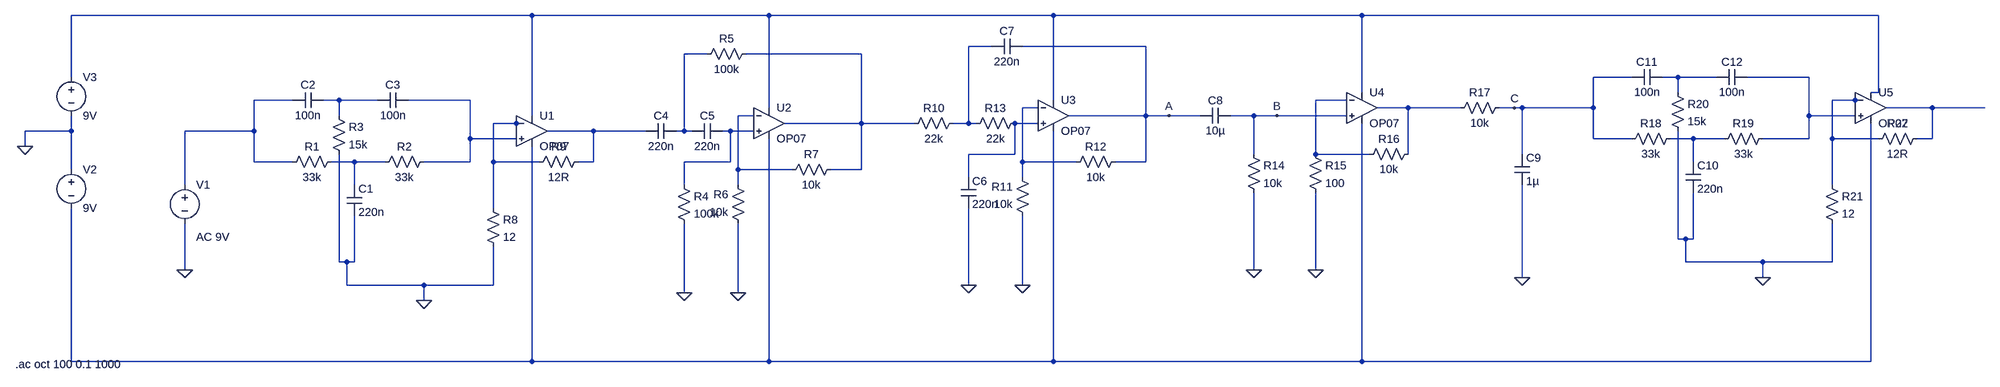
[diagram p0: schematic lab2.asc]
lab2.asc, the LTspice schematic file:
Version 4
SHEET 1 3988 680
WIRE 688 -224 -304 -224
WIRE 1200 -224 688 -224
WIRE 1840 -224 1200 -224
WIRE 2480 -224 1840 -224
WIRE 3600 -224 2480 -224
WIRE 1712 -160 1664 -160
WIRE 2032 -160 1776 -160
WIRE 1072 -144 1024 -144
WIRE 1392 -144 1152 -144
WIRE -304 -96 -304 -224
WIRE 3088 -96 3008 -96
WIRE 3184 -96 3152 -96
WIRE 3264 -96 3184 -96
WIRE 3456 -96 3328 -96
WIRE 2480 -64 2480 -224
WIRE 3184 -64 3184 -96
WIRE 3600 -64 3600 -224
WIRE 3600 -64 3584 -64
WIRE 192 -48 112 -48
WIRE 288 -48 256 -48
WIRE 368 -48 288 -48
WIRE 560 -48 432 -48
WIRE 1840 -48 1840 -224
WIRE 2448 -48 2384 -48
WIRE 3552 -48 3504 -48
WIRE 3568 -48 3552 -48
WIRE 1200 -32 1200 -224
WIRE 1808 -32 1776 -32
WIRE 2576 -32 2512 -32
WIRE 2688 -32 2576 -32
WIRE 2800 -32 2768 -32
WIRE 2816 -32 2800 -32
WIRE 3008 -32 3008 -96
WIRE 3008 -32 2816 -32
WIRE 3712 -32 3616 -32
WIRE 3984 -32 3712 -32
WIRE 288 -16 288 -48
WIRE 688 -16 688 -224
WIRE 1168 -16 1136 -16
WIRE 2032 -16 2032 -160
WIRE 2032 -16 1872 -16
WIRE 2080 -16 2032 -16
WIRE 2144 -16 2080 -16
WIRE 2256 -16 2208 -16
WIRE 2304 -16 2256 -16
WIRE 2448 -16 2304 -16
WIRE 3456 -16 3456 -96
WIRE 3552 -16 3456 -16
WIRE 656 0 608 0
WIRE 672 0 656 0
WIRE 1392 0 1392 -144
WIRE 1392 0 1232 0
WIRE 1552 0 1392 0
WIRE 1664 0 1664 -160
WIRE 1664 0 1632 0
WIRE 1680 0 1664 0
WIRE 1808 0 1760 0
WIRE -304 16 -304 -16
WIRE -304 16 -400 16
WIRE 112 16 112 -48
WIRE 112 16 -32 16
WIRE 816 16 720 16
WIRE 944 16 816 16
WIRE 1024 16 1024 -144
WIRE 1024 16 1008 16
WIRE 1040 16 1024 16
WIRE 1120 16 1104 16
WIRE 1168 16 1120 16
WIRE 560 32 560 -48
WIRE 656 32 560 32
WIRE 3008 32 3008 -32
WIRE 3088 32 3008 32
WIRE 3216 32 3168 32
WIRE 3280 32 3216 32
WIRE 3456 32 3456 -16
WIRE 3456 32 3360 32
WIRE 3504 32 3504 -48
WIRE 3600 32 3504 32
WIRE 3712 32 3712 -32
WIRE 3712 32 3680 32
WIRE -400 48 -400 16
WIRE 1760 64 1760 0
WIRE 1760 64 1664 64
WIRE 2256 64 2256 -16
WIRE 2384 64 2384 -48
WIRE 2496 64 2384 64
WIRE 2576 64 2576 -32
WIRE 2816 64 2816 -32
WIRE 112 80 112 16
WIRE 192 80 112 80
WIRE 320 80 272 80
WIRE 384 80 320 80
WIRE 560 80 560 32
WIRE 560 80 464 80
WIRE 608 80 608 0
WIRE 704 80 608 80
WIRE 816 80 816 16
WIRE 816 80 784 80
WIRE 1120 80 1120 16
WIRE 1120 80 1024 80
WIRE 1776 80 1776 -32
WIRE 1888 80 1776 80
WIRE 2032 80 2032 -16
WIRE 2032 80 1968 80
WIRE 3216 80 3216 32
WIRE -304 96 -304 16
WIRE 1136 96 1136 -16
WIRE 1248 96 1136 96
WIRE 1392 96 1392 0
WIRE 1392 96 1328 96
WIRE 1664 112 1664 64
WIRE 1776 112 1776 80
WIRE -32 128 -32 16
WIRE 320 128 320 80
WIRE 1024 128 1024 80
WIRE 1136 128 1136 96
WIRE 3504 128 3504 32
WIRE 608 176 608 80
WIRE 3184 240 3184 16
WIRE 3200 240 3184 240
WIRE 3216 240 3216 144
WIRE 3216 240 3200 240
WIRE 288 288 288 64
WIRE 304 288 288 288
WIRE 320 288 320 192
WIRE 320 288 304 288
WIRE 3200 288 3200 240
WIRE 3360 288 3200 288
WIRE 3504 288 3504 208
WIRE 3504 288 3360 288
WIRE -32 304 -32 208
WIRE 2256 304 2256 144
WIRE 2384 304 2384 144
WIRE 2816 320 2816 128
WIRE 3360 320 3360 288
WIRE 304 336 304 288
WIRE 464 336 304 336
WIRE 608 336 608 256
WIRE 608 336 464 336
WIRE 1664 336 1664 176
WIRE 1776 336 1776 192
WIRE 1024 352 1024 208
WIRE 1136 352 1136 208
WIRE 464 368 464 336
WIRE -304 496 -304 176
WIRE 688 496 688 48
WIRE 688 496 -304 496
WIRE 1200 496 1200 32
WIRE 1200 496 688 496
WIRE 1840 496 1840 16
WIRE 1840 496 1200 496
WIRE 2480 496 2480 0
WIRE 2480 496 1840 496
WIRE 3584 496 3584 0
WIRE 3584 496 2480 496
FLAG -32 304 0
FLAG -400 48 0
FLAG 1136 352 0
FLAG 1024 352 0
FLAG 1776 336 0
FLAG 1664 336 0
FLAG 2256 304 0
FLAG 2384 304 0
FLAG 2816 320 0
FLAG 2080 -16 A
FLAG 2304 -16 B
FLAG 2800 -32 C
FLAG 464 368 0
FLAG 3360 320 0
SYMBOL voltage -32 112 R0
WINDOW 123 24 124 Left 2
WINDOW 39 0 0 Left 2
SYMATTR InstName V1
SYMATTR Value ""
SYMATTR Value2 AC 9V
SYMBOL res 288 64 R90
WINDOW 0 0 56 VBottom 2
WINDOW 3 32 56 VTop 2
SYMATTR InstName R1
SYMATTR Value 33k
SYMBOL res 480 64 R90
WINDOW 0 0 56 VBottom 2
WINDOW 3 32 56 VTop 2
SYMATTR InstName R2
SYMATTR Value 33k
SYMBOL cap 304 128 R0
SYMATTR InstName C1
SYMATTR Value 220n
SYMBOL cap 256 -64 R90
WINDOW 0 0 32 VBottom 2
WINDOW 3 32 32 VTop 2
SYMATTR InstName C2
SYMATTR Value 100n
SYMBOL cap 432 -64 R90
WINDOW 0 0 32 VBottom 2
WINDOW 3 32 32 VTop 2
SYMATTR InstName C3
SYMATTR Value 100n
SYMBOL res 272 -32 R0
SYMATTR InstName R3
SYMATTR Value 15k
SYMBOL Opamps\\OP07 688 -48 R0
SYMATTR InstName U1
SYMBOL voltage -304 80 R0
WINDOW 123 0 0 Left 2
WINDOW 39 0 0 Left 2
SYMATTR InstName V2
SYMATTR Value 9V
SYMBOL voltage -304 -112 R0
WINDOW 123 0 0 Left 2
WINDOW 39 0 0 Left 2
SYMATTR InstName V3
SYMATTR Value 9V
SYMBOL Opamps\\OP07 1200 -64 R0
SYMATTR InstName U2
SYMBOL cap 1008 0 R90
WINDOW 0 0 32 VBottom 2
WINDOW 3 32 32 VTop 2
SYMATTR InstName C4
SYMATTR Value 220n
SYMBOL cap 1104 0 R90
WINDOW 0 0 32 VBottom 2
WINDOW 3 32 32 VTop 2
SYMATTR InstName C5
SYMATTR Value 220n
SYMBOL res 1168 -160 R90
WINDOW 0 0 56 VBottom 2
WINDOW 3 32 56 VTop 2
SYMATTR InstName R5
SYMATTR Value 100k
SYMBOL res 1152 224 R180
WINDOW 0 36 76 Left 2
WINDOW 3 36 40 Left 2
SYMATTR InstName R6
SYMATTR Value 10k
SYMBOL res 1232 112 R270
WINDOW 0 32 56 VTop 2
WINDOW 3 0 56 VBottom 2
SYMATTR InstName R7
SYMATTR Value 10k
SYMBOL res 1008 112 R0
SYMATTR InstName R4
SYMATTR Value 100k
SYMBOL res 592 160 R0
SYMATTR InstName R8
SYMATTR Value 12
SYMBOL Opamps\\OP07 1840 -80 R0
SYMATTR InstName U3
SYMBOL res 1792 208 R180
WINDOW 0 36 76 Left 2
WINDOW 3 36 40 Left 2
SYMATTR InstName R11
SYMATTR Value 10k
SYMBOL res 1872 96 R270
WINDOW 0 32 56 VTop 2
WINDOW 3 0 56 VBottom 2
SYMATTR InstName R12
SYMATTR Value 10k
SYMBOL res 1648 -16 R90
WINDOW 0 0 56 VBottom 2
WINDOW 3 32 56 VTop 2
SYMATTR InstName R10
SYMATTR Value 22k
SYMBOL res 1776 -16 R90
WINDOW 0 0 56 VBottom 2
WINDOW 3 32 56 VTop 2
SYMATTR InstName R13
SYMATTR Value 22k
SYMBOL cap 1648 112 R0
SYMATTR InstName C6
SYMATTR Value 220n
SYMBOL cap 1776 -176 R90
WINDOW 0 0 32 VBottom 2
WINDOW 3 32 32 VTop 2
SYMATTR InstName C7
SYMATTR Value 220n
SYMBOL cap 2208 -32 R90
WINDOW 0 0 32 VBottom 2
WINDOW 3 32 32 VTop 2
SYMATTR InstName C8
SYMATTR Value 10µ
SYMBOL res 2240 48 R0
SYMATTR InstName R14
SYMATTR Value 10k
SYMBOL Opamps\\OP07 2480 -96 R0
SYMATTR InstName U4
SYMBOL res 2368 48 R0
SYMATTR InstName R15
SYMATTR Value 100
SYMBOL res 2592 48 R90
WINDOW 0 0 56 VBottom 2
WINDOW 3 32 56 VTop 2
SYMATTR InstName R16
SYMATTR Value 10k
SYMBOL cap 2800 64 R0
SYMATTR InstName C9
SYMATTR Value 1µ
SYMBOL res 2784 -48 R90
WINDOW 0 0 56 VBottom 2
WINDOW 3 32 56 VTop 2
SYMATTR InstName R17
SYMATTR Value 10k
SYMBOL res 800 64 R90
WINDOW 0 0 56 VBottom 2
WINDOW 3 32 56 VTop 2
SYMATTR InstName R9
SYMATTR Value 12R
SYMBOL res 3184 16 R90
WINDOW 0 0 56 VBottom 2
WINDOW 3 32 56 VTop 2
SYMATTR InstName R18
SYMATTR Value 33k
SYMBOL res 3376 16 R90
WINDOW 0 0 56 VBottom 2
WINDOW 3 32 56 VTop 2
SYMATTR InstName R19
SYMATTR Value 33k
SYMBOL cap 3200 80 R0
SYMATTR InstName C10
SYMATTR Value 220n
SYMBOL cap 3152 -112 R90
WINDOW 0 0 32 VBottom 2
WINDOW 3 32 32 VTop 2
SYMATTR InstName C11
SYMATTR Value 100n
SYMBOL cap 3328 -112 R90
WINDOW 0 0 32 VBottom 2
WINDOW 3 32 32 VTop 2
SYMATTR InstName C12
SYMATTR Value 100n
SYMBOL res 3168 -80 R0
SYMATTR InstName R20
SYMATTR Value 15k
SYMBOL Opamps\\OP07 3584 -96 R0
SYMATTR InstName U5
SYMBOL res 3488 112 R0
SYMATTR InstName R21
SYMATTR Value 12
SYMBOL res 3696 16 R90
WINDOW 0 0 56 VBottom 2
WINDOW 3 32 56 VTop 2
SYMATTR InstName R22
SYMATTR Value 12R
TEXT -420 502 Left 2 !.ac oct 100 0.1 1000

The netlist it stands for:
* lab2.asc
V1 N007 0 AC 9V
R1 N021 N007 33k
R2 N009 N021 33k
C1 N021 0 220n
C2 N008 N007 100n
C3 N009 N008 100n
R3 N008 0 15k
XU1 N009 N016 N001 N022 N018 LT1001  ; OP07, pins In+ In- V+ V- OUT
V2 0 N022 9V
V3 N001 0 9V
XU2 N019 N015 N001 N022 N004 LT1001  ; OP07, pins In+ In- V+ V- OUT
C4 N003 N018 220n
C5 N019 N003 220n
R5 N004 N003 100k
R6 0 N015 10k
R7 N015 N004 10k
R4 N019 0 100k
R8 N016 0 12
XU3 N017 N012 N001 N022 A LT1001  ; OP07, pins In+ In- V+ V- OUT
R11 0 N012 10k
R12 N012 A 10k
R10 N002 N004 22k
R13 N017 N002 22k
C6 N017 0 220n
C7 A N002 220n
C8 B A 10µ
R14 B 0 10k
XU4 B N010 N001 N022 N013 LT1001  ; OP07, pins In+ In- V+ V- OUT
R15 N010 0 100
R16 N013 N010 10k
C9 C 0 1µ
R17 C N013 10k
R9 N018 N016 12R
R18 N020 C 33k
R19 N006 N020 33k
C10 N020 0 220n
C11 N005 C 100n
C12 N006 N005 100n
R20 N005 0 15k
XU5 N006 N011 N001 N022 N014 LT1001  ; OP07, pins In+ In- V+ V- OUT
R21 N011 0 12
R22 N014 N011 12R
.ac oct 100 0.1 1000
.lib LTC.lib
.backanno
.end